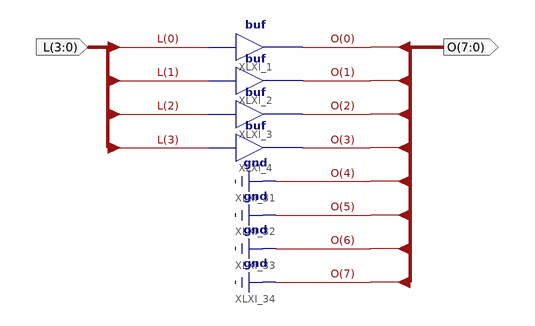
[diagram p0: schematic sheet 1]
// Xilinx ISE schematic resize4x8x0l.sch (spartan6) as structural Verilog: 4 symbols, 2 ports
module resize4x8x0l (
  input  [3:0] L,
  output [7:0] O
);

  buf XLXI_1 (O[0], L[0]);
  buf XLXI_2 (O[1], L[1]);
  buf XLXI_3 (O[2], L[2]);
  buf XLXI_4 (O[3], L[3]);

  assign O[7:4] = 4'b0000;
endmodule
